# EAGLE design control panel2 (EAGLE 8.7.0)
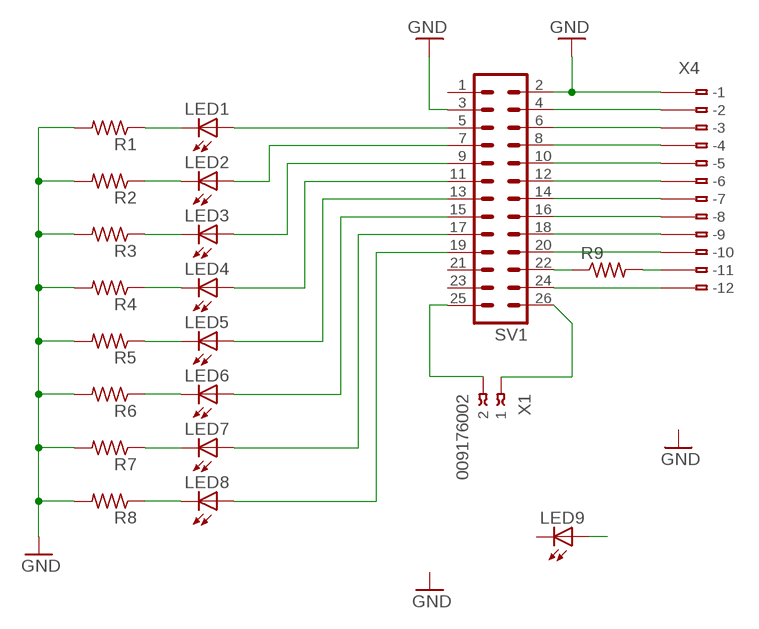
[diagram p0: schematic, sheet 1]

## Parts
LED1  LED3MM  [LED3MM]
LED2  LED3MM  [LED3MM]
LED3  LED3MM  [LED3MM]
LED4  LED3MM  [LED3MM]
LED5  LED3MM  [LED3MM]
LED6  LED3MM  [LED3MM]
LED7  LED3MM  [LED3MM]
LED8  LED3MM  [LED3MM]
LED9  LED3MM  [LED3MM]
R1  R-US_0309/V  [0309V]
R2  R-US_0309/V  [0309V]
R3  R-US_0309/V  [0309V]
R4  R-US_0309/V  [0309V]
R5  R-US_0309/V  [0309V]
R6  R-US_0309/V  [0309V]
R7  R-US_0309/V  [0309V]
R8  R-US_0309/V  [0309V]
R9  R-US_0204/7  [0204/7]
SV1  MA13-2  [MA13-2]
X1  009176002  [009176002]
X4  233-212  [233-212]

## Nets
GND: R1.2 R2.2 R3.2 R4.2 R5.2 R6.2 R7.2 R8.2 SV1.2 SV1.3 X4.B1(B-1)
N$1: LED1.A SV1.5
N$2: LED2.A SV1.7
N$3: LED3.A SV1.9
N$4: LED4.A SV1.11
N$5: LED5.A SV1.13
N$6: LED6.A SV1.15
N$7: LED7.A SV1.17
N$8: LED8.A SV1.19
N$9: LED1.K(C) R1.1
N$10: LED2.K(C) R2.1
N$11: LED3.K(C) R3.1
N$12: LED4.K(C) R4.1
N$13: LED5.K(C) R5.1
N$14: LED6.K(C) R6.1
N$15: LED7.K(C) R7.1
N$16: LED8.K(C) R8.1
N$17: SV1.24 X4.B12(B-12)
N$18: SV1.4 X4.B2(B-2)
N$19: SV1.6 X4.B3(B-3)
N$20: SV1.8 X4.B4(B-4)
N$21: SV1.10 X4.B5(B-5)
N$22: SV1.12 X4.B6(B-6)
N$23: SV1.14 X4.B7(B-7)
N$24: SV1.16 X4.B8(B-8)
N$25: SV1.25 X1.2
N$26: SV1.26 X1.1
N$27: SV1.18 X4.B9(B-9)
N$28: SV1.20 X4.B10(B-10)
N$30: LED9.A
N$31: R9.1 SV1.22
N$32: R9.2 X4.B11(B-11)
Unconnected: LED9.K(C) SV1.1 SV1.21 SV1.23 X4.A1(-1) X4.A2(-2) X4.A3(-3) X4.A4(-4) X4.A5(-5) X4.A6(-6) X4.A7(-7) X4.A8(-8) X4.A9(-9) X4.A10(-10) X4.A11(-11) X4.A12(-12)

## Library data of the parts
LED1-LED9 = adafruit:LED: LED OSRAM: - CHIPLED LG R971, LG N971, LY N971, LG Q971, LY Q971, LO R971, LY R971 LH N974, LH R974 LS Q976, LO Q976, LY Q976 LO Q996 - Hyper CHIPLED LW Q18S LB Q993, LB Q99A, LB R99A - SideLED LS A670, LO A670, LY A670, LG A670, LP A670 LB A673, LV A673, LT A673, LW A673 LH A674 LY A675 LS A676, LA A676, LO A676, LY A676, LW A676 LS A679, LY A679, LG A679 - Hyper Micro SIDELED® LS Y876, LA Y876, LO Y876, LY Y876 LT Y87S - SmartLED LW L88C, LW L88S LB L89C, LB L89S, LG L890 LS L89K, LO L89K, LY L89K LS L896, LA L896, LO L896, LY L896 - TOPLED LS T670, LO T670, LY T670, LG T670, LP T670 LSG T670, LSP T670, LSY T670, LOP T670, LYG T670 LG T671, LOG T671, LSG T671 LB T673, LV T673, LT T673, LW T673 LH T674 LS T676, LA T676, LO T676, LY T676, LB T676, LH T676, LSB T676, LW T676 LB T67C, LV T67C, LT T67C, LS T67K, LO T67K, LY T67K, LW E67C LS E67B, LA E67B, LO E67B, LY E67B, LB E67C, LV E67C, LT E67C LW T67C LS T679, LY T679, LG T679 LS T770, LO T770, LY T770, LG T770, LP T770 LB T773, LV T773, LT T773, LW T773 LH T774 LS E675, LA E675, LY E675, LS T675 LS T776, LA T776, LO T776, LY T776, LB T776 LHGB T686 LT T68C, LB T68C - Hyper Mini TOPLED® LB M676 - Mini TOPLED Santana® LG M470 LS M47K, LO M47K, LY M47K Source: http://www.osram.convergy.de/
R1-R9 = resistor:R-US_: RESISTOR, American symbol
SV1 = con-lstb:MA13-2: PIN HEADER; OC_FARNELL: unknown; OC_NEWARK: unknown
X1 = con-avx:00917?002: Wire to Board Strip IDC Connector 2 WAY Source: http://www.avx.com/docs/Catalogs/9176.pdf http://www.avx.com/docs/Catalogs/9177.pdf; MPN: 009176002001006; OC_FARNELL: 1582834; OC_NEWARK: 66M1960
X4 = con-wago:233-212: WAGO Cage Clamp; MPN: 233-212; OC_FARNELL: 1283538; OC_NEWARK: 28K9068

## Board
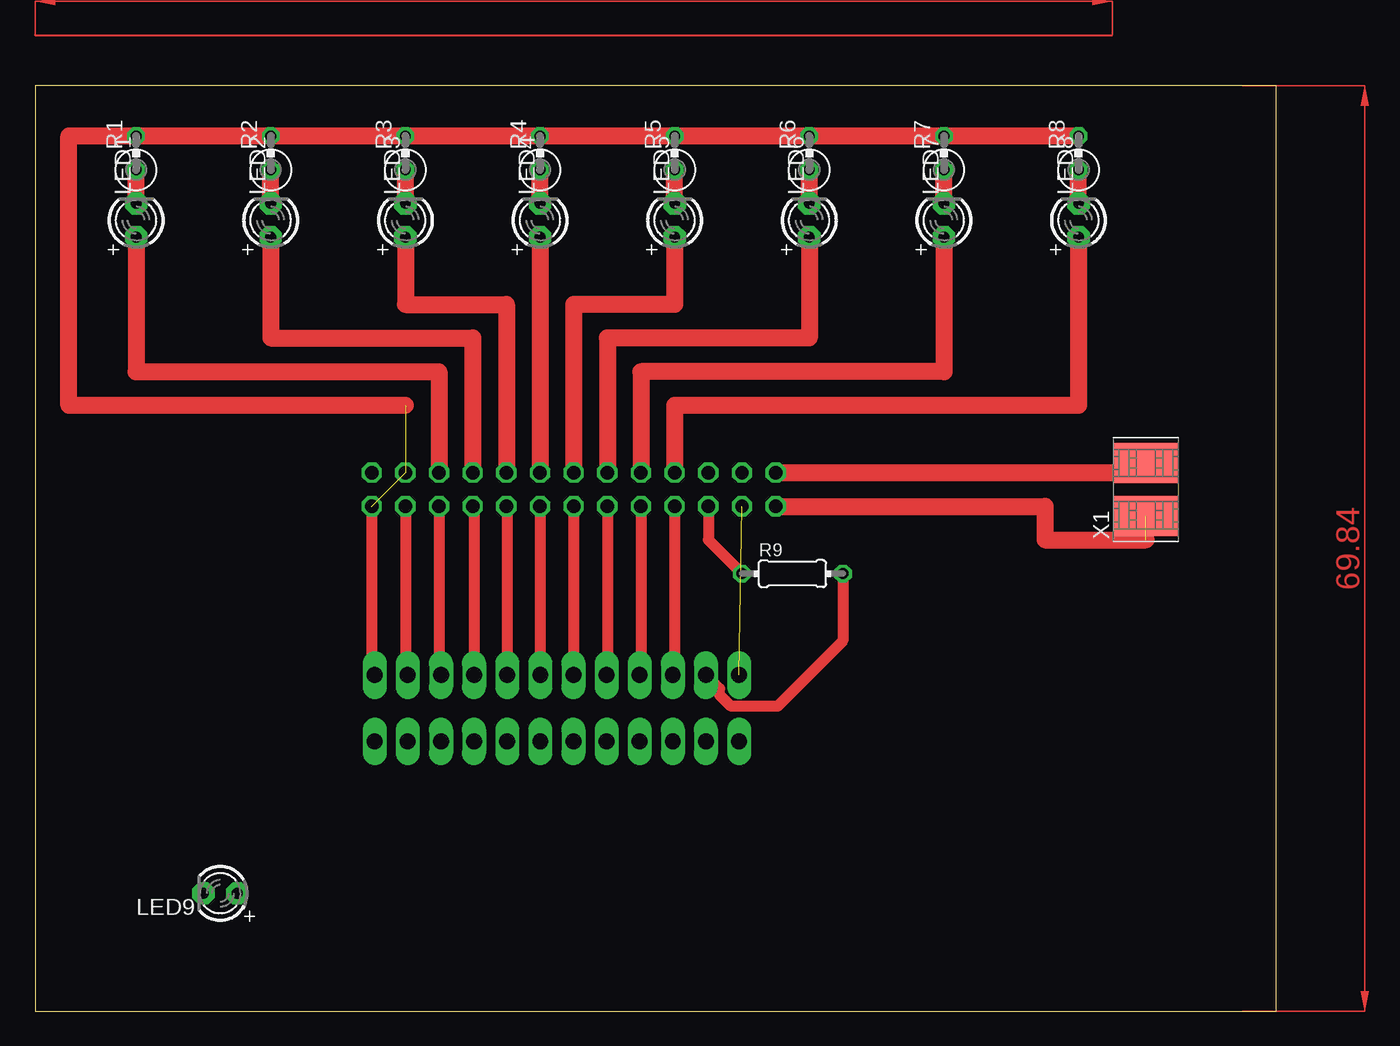
[diagram p1: board, top side]
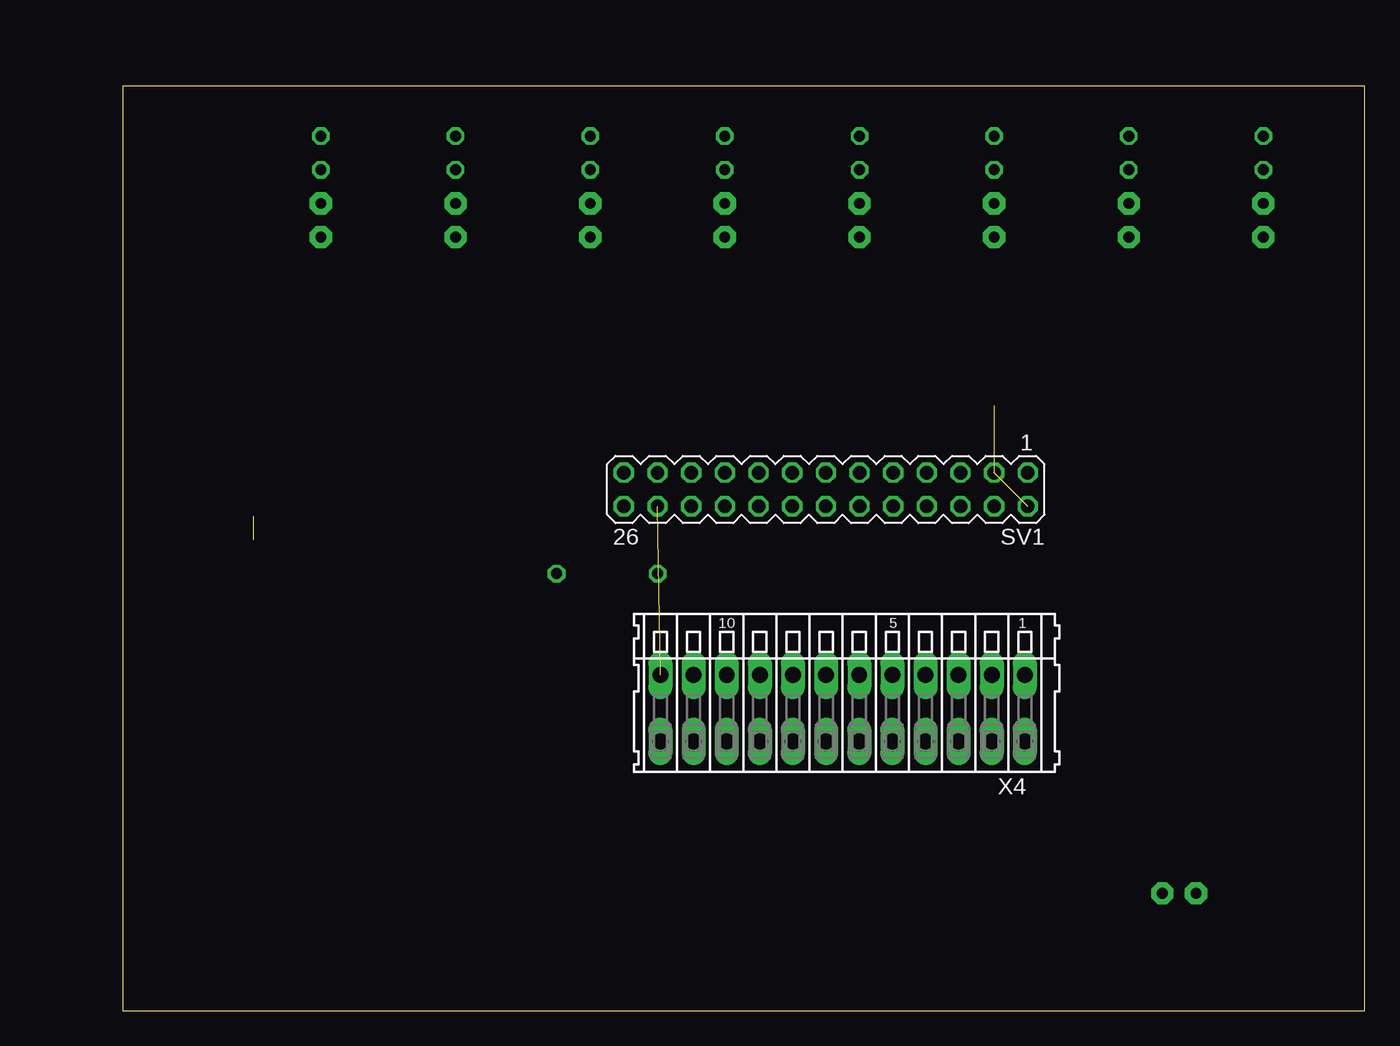
[diagram p2: board, bottom side, seen from below]

Size 93.65 x 69.85 mm. Coordinates in mm from the lower left corner, seen from the top.
Outline: 0,0 93.65,0 93.65,69.84 0.01,69.85 0,0
Copper layers (1*16): Top 0.035mm / dielectric 1.5mm / Bottom 0.035mm
Design rules "default": minimum track width 6mil, minimum drill 0.35mm, track to track 6mil, track to pad 6mil, pad to pad 6mil, via to via 6mil, smd to smd 6mil, copper to edge 40mil, drill to drill 6mil, minimum pad ring 10mil, minimum via ring 8mil, stop-mask expansion 4mil, vias tented up to drill 0mil, thermal gap 10mil

### Footprints (pad centres in the part's own frame; a part is rotated, then mirrored left to right if it is on the bottom)
LED3MM = drill 0.813 pad 1.676 octagon: A -1.27,0; K 1.27,0
0309V = drill 0.813 octagon: 1 -1.27,0; 2 1.27,0
0204/7 = drill 0.813 octagon: 1 -3.81,0; 2 3.81,0
MA13-2 = drill 1.016 octagon: 1 -15.24,-1.27; 2 -15.24,1.27; 3 -12.7,-1.27; 4 -12.7,1.27; 5 -10.16,-1.27; 6 -10.16,1.27; 7 -7.62,-1.27; 8 -7.62,1.27; 9 -5.08,-1.27; 10 -5.08,1.27; 11 -2.54,-1.27; 12 -2.54,1.27; 13 0,-1.27; 14 0,1.27; 15 2.54,-1.27; 16 2.54,1.27; 17 5.08,-1.27; 18 5.08,1.27; 19 7.62,-1.27; 20 7.62,1.27; 21 10.16,-1.27; 22 10.16,1.27; 23 12.7,-1.27; 24 12.7,1.27; 25 15.24,-1.27; 26 15.24,1.27
009176002 = smd 3 x 5: 1 -2,0; 2 2,0
233-212 = drill 1.2 long: A1 -13.75,2.5; A2 -11.25,2.5; A3 -8.75,2.5; A4 -6.25,2.5; A5 -3.75,2.5; A6 -1.25,2.5; A7 1.25,2.5; A8 3.75,2.5; A9 6.25,2.5; A10 8.75,2.5; A11 11.25,2.5; A12 13.75,2.5; B1 -13.75,-2.5; B2 -11.25,-2.5; B3 -8.75,-2.5; B4 -6.25,-2.5; B5 -3.75,-2.5; B6 -1.25,-2.5; B7 1.25,-2.5; B8 3.75,-2.5; B9 6.25,-2.5; B10 8.75,-2.5; B11 11.25,-2.5; B12 13.75,-2.5

### Placement (x,y rotation side)
LED1  7.62,59.69 90 top
LED2  17.78,59.69 90 top
LED3  27.94,59.69 90 top
LED4  38.1,59.69 90 top
LED5  48.26,59.69 90 top
LED6  58.42,59.69 90 top
LED7  68.58,59.69 90 top
LED8  78.74,59.69 90 top
LED9  13.97,8.89 180 top
R1  7.62,64.77 90 top
R2  17.78,64.77 90 top
R3  27.94,64.77 90 top
R4  38.1,64.77 90 top
R5  48.26,64.77 90 top
R6  58.42,64.77 90 top
R7  68.58,64.77 90 top
R8  78.74,64.77 90 top
R9  57.15,33.02 0 top
SV1  40.64,39.37 180 bottom
X1  83.82,39.37 90 top
X4  39.37,22.86 180 bottom

### Tracks (layer width: path | path; a pad name or v marks a point on that pad's centre or on a via)
GND  (2 unrouted)
  Top 0.152: 25.49,25.49 X4.B1
  Top 0.813: SV1.2 25.4,25.58 25.49,25.49
  Top 1.27: R8.2 R7.2 R6.2 R5.2 R4.2 R3.2 R2.2 R1.2 2.54,66.04 2.54,45.72 27.94,45.72
N$1
  Top 1.27: LED1.A 7.62,48.26 30.48,48.26 SV1.5
N$2
  Top 1.27: LED2.A 17.78,50.8 33.02,50.8 SV1.7
N$3
  Top 1.27: LED3.A 27.94,53.34 35.56,53.34 SV1.9
N$4
  Top 1.27: LED4.A SV1.11
N$5
  Top 1.27: LED5.A 48.26,53.34 40.64,53.34 SV1.13
N$6
  Top 1.27: LED6.A 58.42,50.8 43.18,50.8 SV1.15
N$7
  Top 1.27: LED7.A 68.58,48.26 45.72,48.26 SV1.17
N$8
  Top 1.27: LED8.A 78.74,45.72 48.26,45.72 SV1.19
N$9
  Top 1.27: LED1.K R1.1
N$10
  Top 1.27: LED2.K R2.1
N$11
  Top 1.27: LED3.K R3.1
N$12
  Top 1.27: LED4.K R4.1
N$13
  Top 1.27: LED5.K R5.1
N$14
  Top 1.27: LED6.K R6.1
N$15
  Top 1.27: LED7.K R7.1
N$16
  Top 1.27: LED8.K R8.1
N$17  (1 unrouted)
N$18
  Top 0.813: SV1.4 27.94,25.54 X4.B2
N$19
  Top 0.813: SV1.6 30.48,25.4 30.52,25.36 X4.B3
N$20
  Top 0.813: SV1.8 33.12,38 X4.B4
N$21
  Top 0.813: SV1.10 35.62,38.04 X4.B5
N$22
  Top 0.813: SV1.12 38.1,24.13 38.12,24.15 X4.B6
N$23
  Top 0.813: SV1.14 40.64,25.38 X4.B7
N$24
  Top 0.813: SV1.16 43.18,25.42 X4.B8
N$25
  Top 1.27: SV1.25 83.09,40.64 X1.2
N$26  (1 unrouted)
  Top 1.27: SV1.26 76.2,38.1 76.2,35.56 83.82,35.56
N$27
  Top 0.813: SV1.18 45.72,25.46 X4.B9
N$28
  Top 0.813: SV1.20 48.26,25.5 X4.B10
N$29
  Top 0.152: 0,73.66 81.28,73.66
N$31
  Top 0.813: SV1.22 50.8,35.56 R9.1
N$32
  Top 0.813: R9.2 60.96,27.94 56.02,23 52.52,23 51.66,23.86 51.66,24.32 X4.B11
(copper drawn outside any net)
  shapes: Top area x2